# EAGLE design prog1840 (EAGLE 4.11)
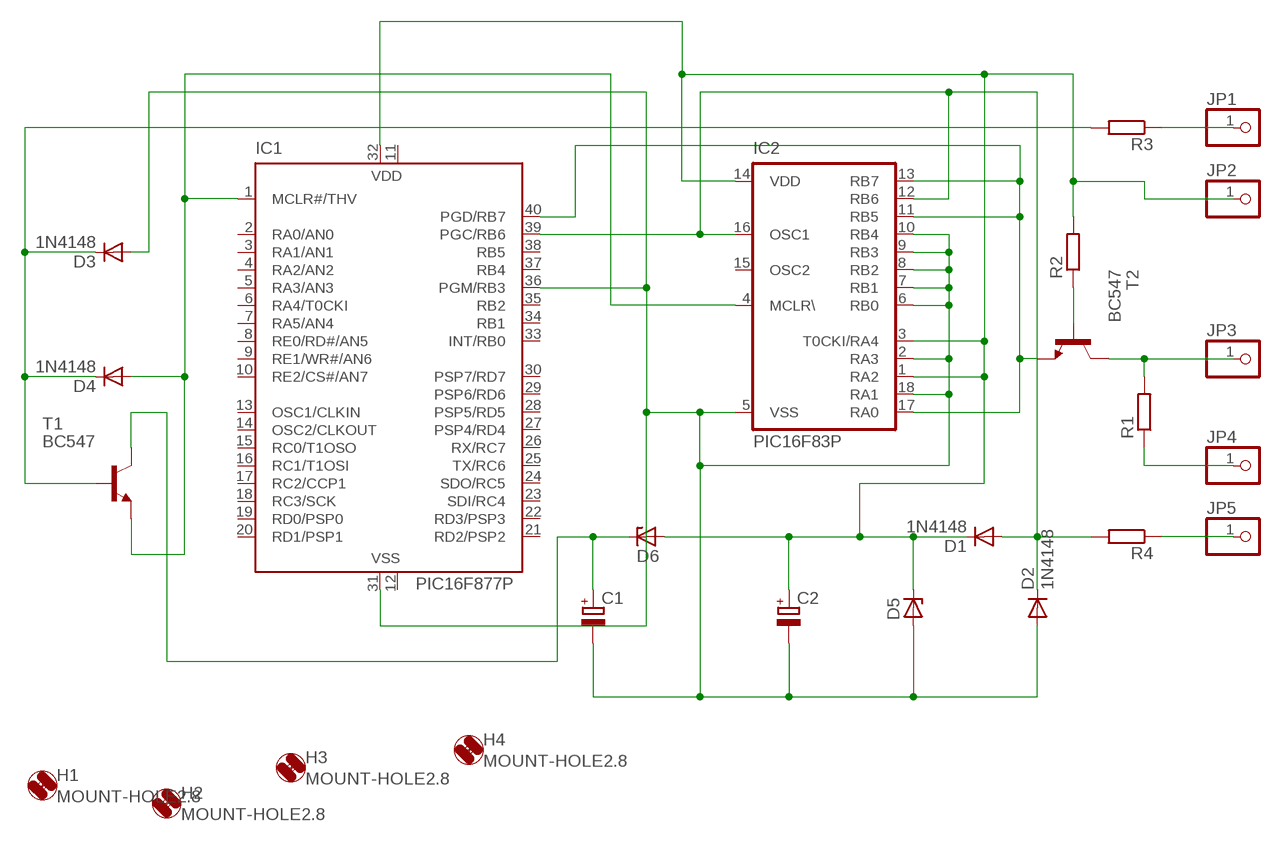
[diagram p0: schematic, sheet 1]

## Parts
C1  CPOL-EUE5-5  [E5-5]
C2  CPOL-EUE5-5  [E5-5]
D1  1N4148  [DO35-10]
D2  1N4148  [DO35-10]
D3  1N4148  [DO35-10]
D4  1N4148  [DO35-10]
D5  ZENER-DIODEF126-10  [F126Z10]
D6  ZENER-DIODEF126-10  [F126Z10]
H1  MOUNT-HOLE2.8  [2,8]
H2  MOUNT-HOLE2.8  [2,8]
H3  MOUNT-HOLE2.8  [2,8]
H4  MOUNT-HOLE2.8  [2,8]
IC1  PIC16F877P  [DIL40]
IC2  PIC16F83P  [DIL18]
JP1  PINHD-1X1  [1X01]
JP2  PINHD-1X1  [1X01]
JP3  PINHD-1X1  [1X01]
JP4  PINHD-1X1  [1X01]
JP5  PINHD-1X1  [1X01]
R1  R-EU_0204/5  [0204/5]
R2  R-EU_0204/5  [0204/5]
R3  R-EU_0204/5  [0204/5]
R4  R-EU_0204/5  [0204/5]
T1  BC547  [TO92]
T2  BC547  [TO92]

## Nets
N$1: JP3.1 R1.2 T2.3(C)
N$2: JP1.1 R3.1
N$3: JP4.1 R1.1
N$4: JP5.1 R4.1
N$5: R2.1 T2.2(B)
N$7: D1.A D2.C IC1.39(PGC/RB6) IC2.12(RB6) IC2.16(OSC1) R4.2
N$8: C2.+ D1.C D5.C D6.A IC1.32(VDD) IC2.1(RA2) IC2.3(T0CKI/RA4) IC2.14(VDD) JP2.1 R2.2
N$12: C1.+ D6.C T1.3(C)
N$14: D3.C D4.C R3.2 T1.2(B)
N$15: D4.A IC1.1(MCLR#/THV) IC2.4(MCLR\) T1.1(E)
N$17: C1.- C2.- D2.A D3.A D5.A IC1.31(VSS) IC1.36(PGM/RB3) IC2.2(RA3) IC2.5(VSS) IC2.6(RB0) IC2.7(RB1) IC2.8(RB2) IC2.9(RB3) IC2.10(RB4) IC2.18(RA1)
N$24: IC1.40(PGD/RB7) IC2.11(RB5) IC2.13(RB7) IC2.17(RA0) T2.1(E)
Unconnected: IC1.2(RA0/AN0) IC1.3(RA1/AN1) IC1.4(RA2/AN2) IC1.5(RA3/AN3) IC1.6(RA4/T0CKI) IC1.7(RA5/AN4) IC1.8(RE0/RD#/AN5) IC1.9(RE1/WR#/AN6) IC1.10(RE2/CS#/AN7) IC1.13(OSC1/CLKIN) IC1.14(OSC2/CLKOUT) IC1.15(RC0/T1OSO) IC1.16(RC1/T1OSI) IC1.17(RC2/CCP1) IC1.18(RC3/SCK) IC1.19(RD0/PSP0) IC1.20(RD1/PSP1) IC1.21(RD2/PSP2) IC1.22(RD3/PSP3) IC1.23(SDI/RC4) IC1.24(SDO/RC5) IC1.25(TX/RC6) IC1.26(RX/RC7) IC1.27(PSP4/RD4) IC1.28(PSP5/RD5) IC1.29(PSP6/RD6) IC1.30(PSP7/RD7) IC1.33(INT/RB0) IC1.34(RB1) IC1.35(RB2) IC1.37(RB4) IC1.38(RB5) IC2.15(OSC2)

## Power pins joined to a net without a drawn wire
VDD: IC1.11(VDD)
VSS: IC1.12(VSS)

## Library data of the parts
C1 C2 = rcl:CPOL-EU: POLARIZED CAPACITOR, European symbol
D1-D4 = diode:1N4148: DIODE high speed (Philips)
D5 D6 = diode:ZENER-DIODE: Z-Diode
H1-H4 = holes:MOUNT-HOLE: MOUNTING HOLE with drill center marker
IC1 = microchip:PIC16F87*: MICROCONTROLLER
IC2 = microchip:PIC16F8*: MICROCONTROLLER 8-Bit PIC16F8X Family - CMOS Flash/EEPROM Pin Compatible : PIC16F83, PIC16CR83, PIC16F84A, PIC16CR84 see also PIC16C*
JP1-JP5 = pinhead:PINHD-1X1: PIN HEADER
R1-R4 = rcl:R-EU_: RESISTOR, European symbol
T1 T2 = transistor:BC547: NPN TRANSISTOR

## Board
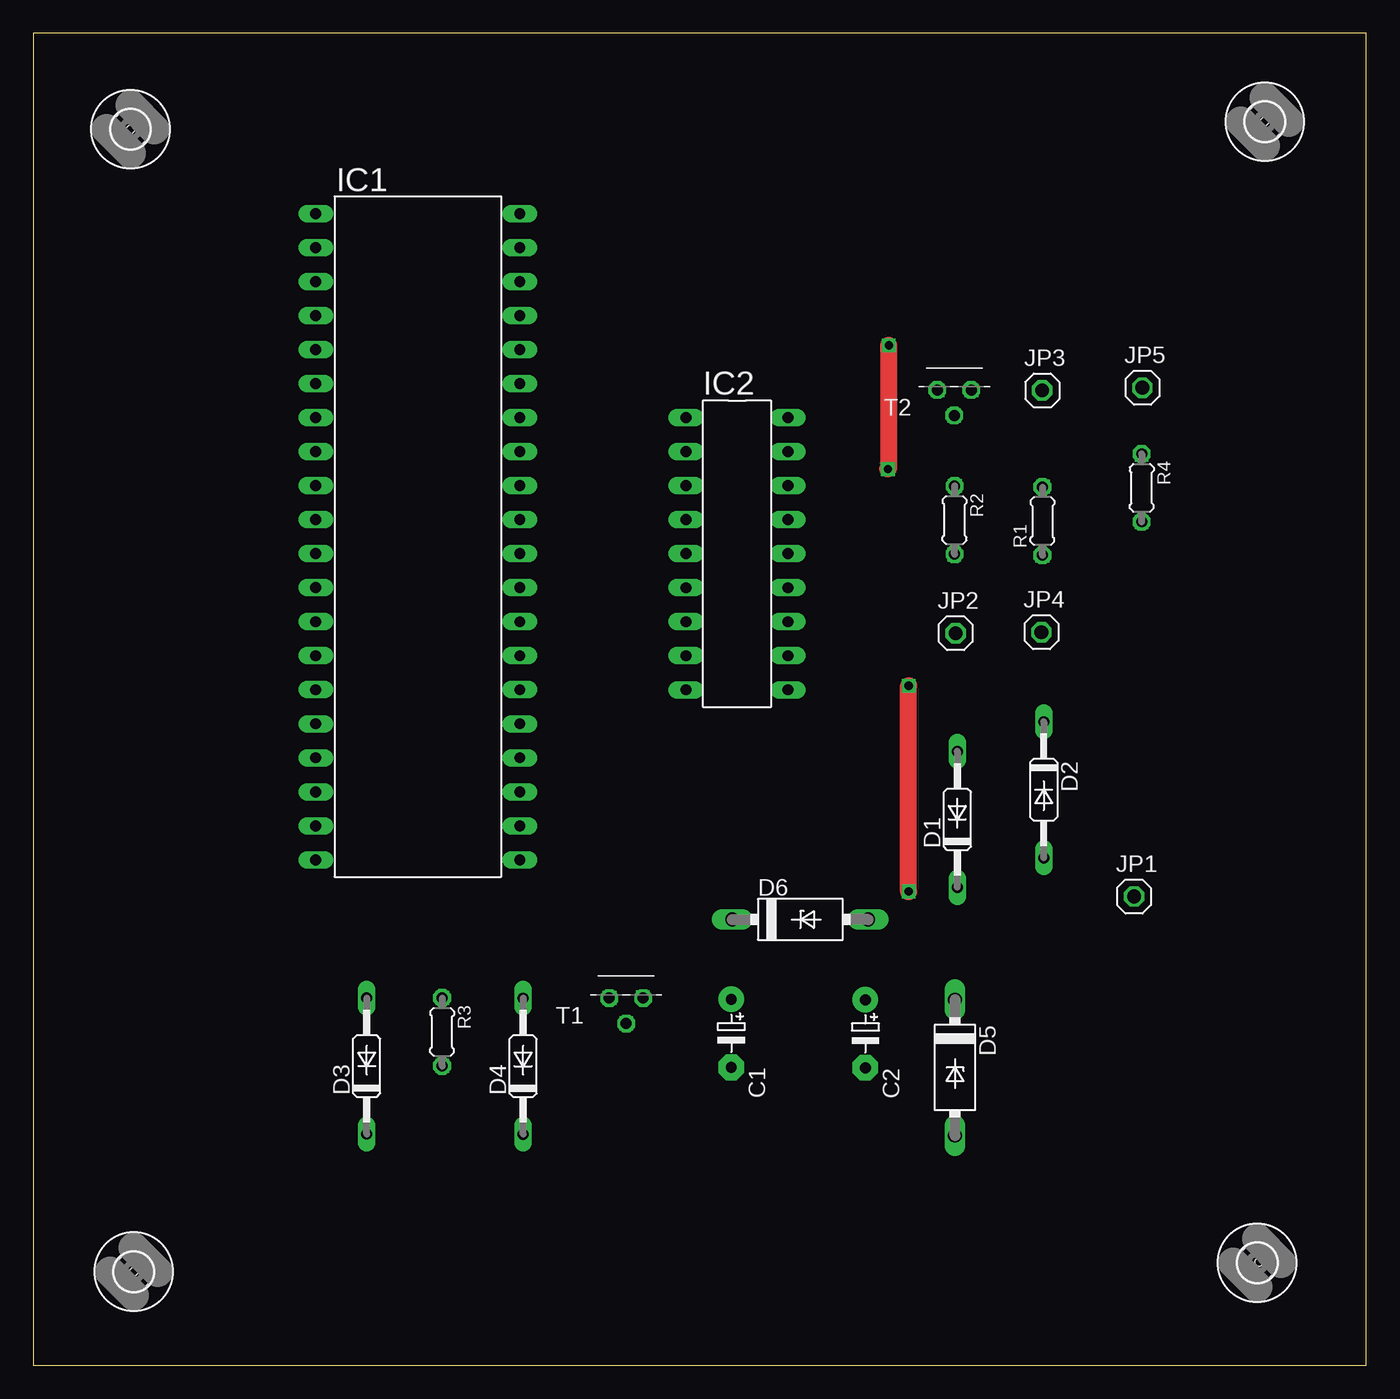
[diagram p1: board, top side]
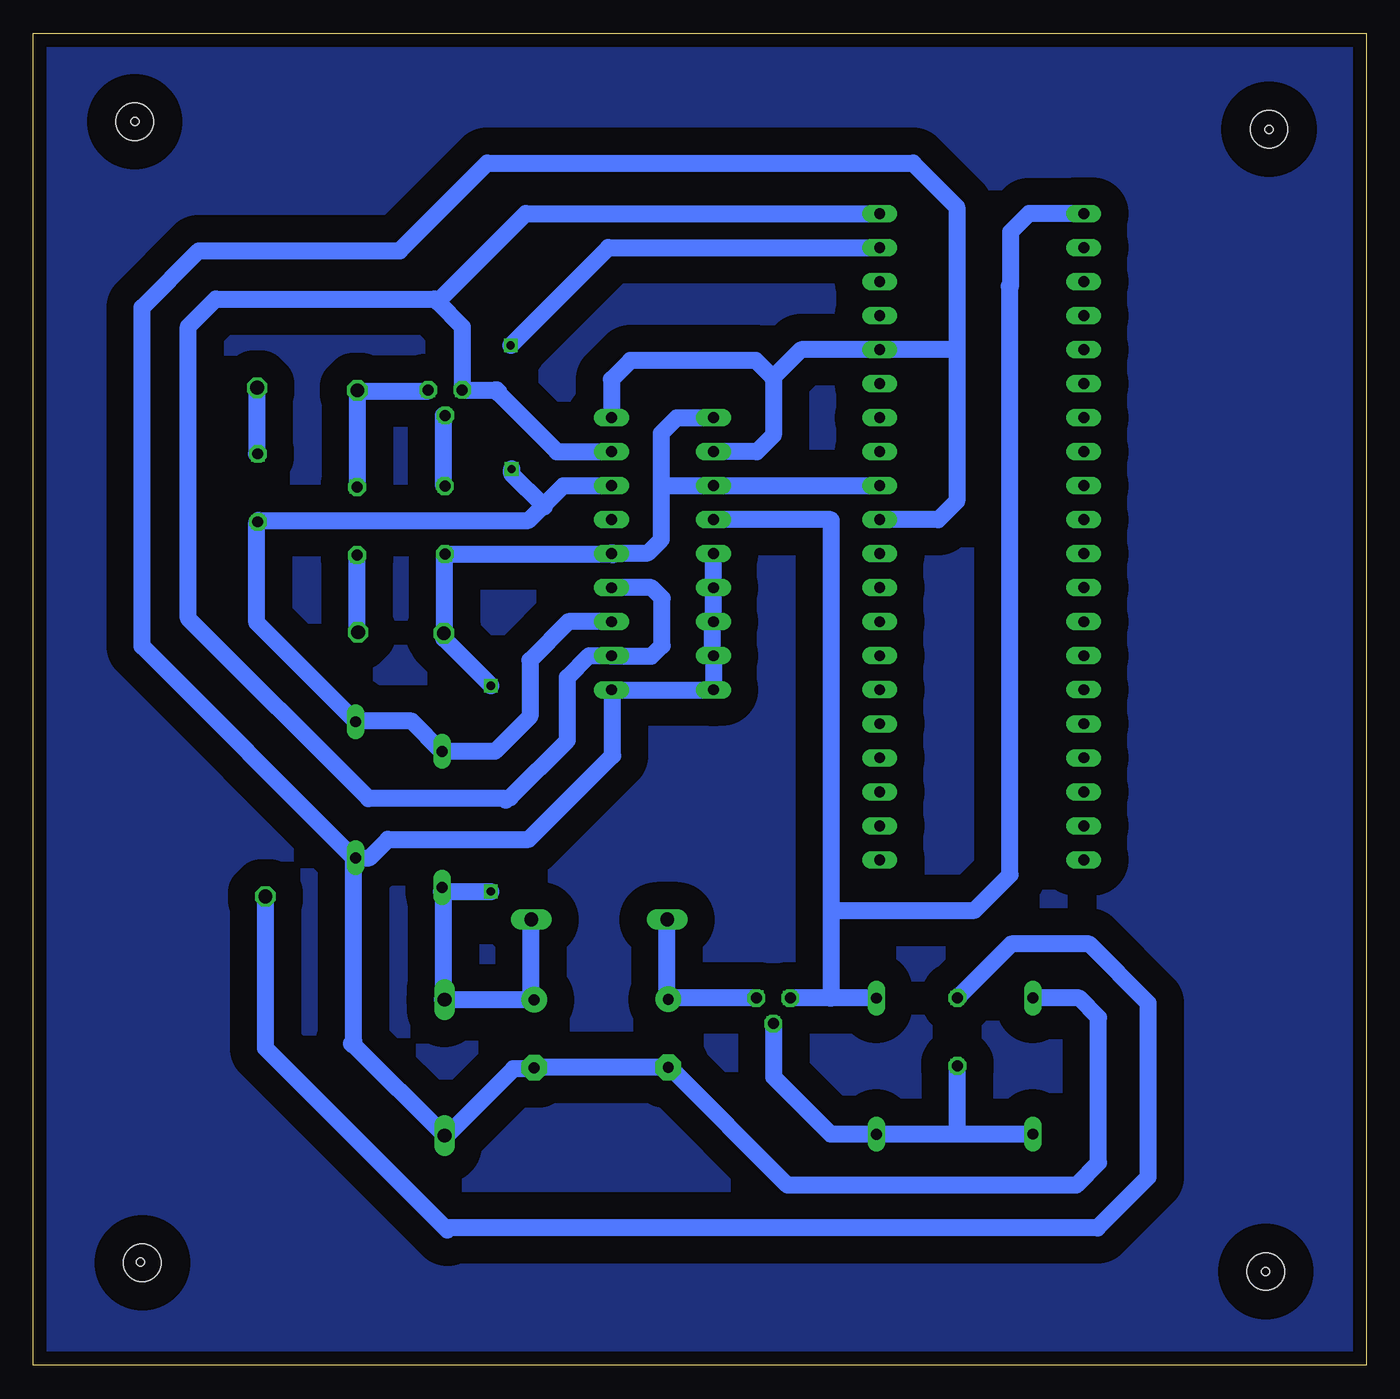
[diagram p2: board, bottom side, seen from below]

Size 99.52 x 99.47 mm. Coordinates in mm from the lower left corner, seen from the top.
Outline: 0,0 99.52,0 99.52,99.47 0,99.47 0,0
Copper layers (1*16): Top 0.035mm / dielectric 1.5mm / Bottom 0.035mm
Design rules "default": minimum track width 10mil, minimum drill 24mil, track to track 80mil, track to pad 80mil, pad to pad 80mil, via to via 80mil, smd to smd 80mil, copper to edge 40mil, drill to drill 8mil, minimum pad ring 10mil, minimum via ring 8mil, stop-mask expansion 4mil, vias tented up to drill 0mil, thermal gap 10mil
Holes 0.61 mm at 91.96,92.92 91.51,7.71 7.52,7 7.25,92.3

### Footprints (pad centres in the part's own frame; a part is rotated, then mirrored left to right if it is on the bottom)
E5-5 = drill 0.813 pad 1.905 round: + -2.54,0 | drill 0.813 pad 1.905 octagon: - 2.54,0
DO35-10 = drill 0.813 long: A 5.08,0; C -5.08,0
F126Z10 = drill 1.016 long: A 5.08,0; C -5.08,0
2,8 = hole 2.8: 0,0
DIL40 = drill 0.813 long: 1 -24.13,-7.62; 2 -21.59,-7.62; 3 -19.05,-7.62; 4 -16.51,-7.62; 5 -13.97,-7.62; 6 -11.43,-7.62; 7 -8.89,-7.62; 8 -6.35,-7.62; 9 -3.81,-7.62; 10 -1.27,-7.62; 11 1.27,-7.62; 12 3.81,-7.62; 13 6.35,-7.62; 14 8.89,-7.62; 15 11.43,-7.62; 16 13.97,-7.62; 17 16.51,-7.62; 18 19.05,-7.62; 19 21.59,-7.62; 20 24.13,-7.62; 21 24.13,7.62; 22 21.59,7.62; 23 19.05,7.62; 24 16.51,7.62; 25 13.97,7.62; 26 11.43,7.62; 27 8.89,7.62; 28 6.35,7.62; 29 3.81,7.62; 30 1.27,7.62; 31 -1.27,7.62; 32 -3.81,7.62; 33 -6.35,7.62; 34 -8.89,7.62; 35 -11.43,7.62; 36 -13.97,7.62; 37 -16.51,7.62; 38 -19.05,7.62; 39 -21.59,7.62; 40 -24.13,7.62
DIL18 = drill 0.813 long: 1 -10.16,-3.81; 2 -7.62,-3.81; 3 -5.08,-3.81; 4 -2.54,-3.81; 5 0,-3.81; 6 2.54,-3.81; 7 5.08,-3.81; 8 7.62,-3.81; 9 10.16,-3.81; 10 10.16,3.81; 11 7.62,3.81; 12 5.08,3.81; 13 2.54,3.81; 14 0,3.81; 15 -2.54,3.81; 16 -5.08,3.81; 17 -7.62,3.81; 18 -10.16,3.81
1X01 = drill 1.016 octagon: 1 0,0
0204/5 = drill 0.813 octagon: 1 -2.54,0; 2 2.54,0
TO92 = drill 0.813 octagon: 1 1.27,0; 2 0,1.905; 3 -1.27,0

### Placement (x,y rotation side)
C1  52.11,24.8 270 top
C2  62.13,24.77 270 top
D1  69,40.78 90 top
D2  75.45,42.99 270 top
D3  24.89,22.36 90 top
D4  36.56,22.35 90 top
D5  68.82,22.25 270 top
D6  57.27,33.3 0 top
H1  91.96,92.89 0 top
H2  7.24,92.32 0 top
H3  91.39,7.67 0 top
H4  7.49,7.01 0 top
IC1  28.7,61.89 270 top
IC2  52.54,60.62 270 top
JP1  82.18,35.02 0 top
JP2  68.87,54.68 0 top
JP3  75.34,72.81 0 top
JP4  75.28,54.77 0 top
JP5  82.82,73.02 0 top
R1  75.35,63.05 90 top
R2  68.79,63.13 270 top
R3  30.52,24.91 270 top
R4  82.77,65.54 270 top
T1  44.26,27.44 180 top
T2  68.77,72.85 180 top

### Tracks (layer width: path | path; a pad name or v marks a point on that pad's centre or on a via)
N$1
  Bottom 1.27: R1.2 75.3,65.65 75.3,72.65 | 75.3,72.65 75.3,72.82 75.33,72.82 JP3.1 75.4,72.75 75.43,72.75 | T2.3 70.14,72.75 75.2,72.75 75.29,72.65 75.3,72.65
N$2
  Bottom 1.27: R3.1 26.5,31.46 20.68,31.46 16.26,27.05 16.26,14.07 20.06,10.27 68.59,10.27 | 68.59,10.27 68.73,10.27 | 68.59,10.27 68.59,10.1 82.18,23.69 JP1.1
N$3
  Bottom 1.27: 75.37,54.68 75.37,54.67 | JP4.1 75.37,54.68 | R1.1 75.37,60.5 75.37,54.68
N$4
  Bottom 1.27: R4.1 82.87,68.08 82.82,68.14 JP5.1
N$5
  Bottom 1.27: T2.2 68.8,70.97 68.89,70.97 68.89,65.78 R2.1
N$6  (via drill 0.61)
  other vias: 21.03,86.03
N$7  (via drill 0.61)
  Top 1.27: v63.89,76.18 63.89,67.02 v63.81,66.94
  Bottom 1.27: IC2.16 59.95,65.7 61.44,64.21 | 61.44,64.21 62.55,63.1 82.73,63.1 82.82,63.01 82.81,63 R4.2 82.83,62.95 82.85,62.95 82.85,55.47 75.55,48.17 | 75.55,48.17 D2.C | 75.55,48.17 75.52,48.2 75.43,48.11 71.28,48.11 69.03,45.86 D1.A 69,45.83 68.98,45.81 68.94,45.86 65.05,45.86 62.45,48.46 62.45,52.66 59.56,55.54 IC2.12 | IC1.39 56.58,83.48 v63.89,76.18 | 61.44,64.21 61.37,64.14 | 61.44,64.21 | v63.81,66.94 63.81,66.58 61.44,64.21
N$8  (via drill 0.61)
  Top 1.27: v65.36,35.39 v65.36,50.76
  Bottom 1.27: 68.88,27.27 68.88,27.24 68.81,27.24 | 68.88,27.27 68.88,27.33 D5.C 68.98,27.33 | 68.81,27.24 68.81,27.17 | C2.+ 62.36,27.3 | 62.36,27.3 68.81,27.3 68.81,27.24 | IC2.1 51.47,70.78 52.62,69.63 52.62,65.69 | 52.62,65.69 52.62,61.69 53.64,60.68 56.26,60.68 | 56.44,60.62 | 56.44,60.62 IC2.14 56.35,60.64 56.38,60.68 | 56.26,60.68 56.38,60.68 | 56.38,60.68 56.44,60.62 | 52.62,65.69 52.61,65.7 IC2.3 48.6,65.7 48.58,65.68 48.56,65.7 IC1.32 | 56.38,60.68 56.47,60.59 | 56.26,60.68 56.26,60.56 56.3,60.59 R2.2 68.82,60.56 68.82,54.73 JP2.1 68.87,54.27 v65.36,50.76 | 68.88,27.27 68.89,27.27 | D1.C 68.89,35.59 68.89,35.39 | D6.A 62.36,27.3 | 68.89,35.39 69.07,35.39 | 68.89,35.39 v65.36,35.39 | 68.98,27.33 68.99,27.31 | 68.89,35.39 68.89,27.41 68.98,27.33
N$9  (via drill 0.61)
  other vias: 21.03,83.56
N$10  (via drill 0.61)
  other vias: 36.31,85.99
N$11  (via drill 0.61)
  other vias: 36.36,83.47
N$12
  Bottom 1.27: 52.24,27.31 52.24,27.34 C1.+ 52,27.34 | 52,27.34 52,27.27 | 52,27.27 | T1.3 52,27.44 52,27.34 | 52,27.27 52.03,27.27 52.19,27.44 D6.C
N$13  (via drill 0.61)
  other vias: 36.31,80.95
N$14
  Bottom 1.27: 36.54,17.27 36.54,17.2 | 36.54,17.27 D4.C 39.97,17.27 44.23,21.53 44.23,25.5 T1.2 | 36.54,17.27 36.54,17.28 | D3.C 24.89,17.3 25.01,17.42 25.16,17.27 30.84,17.27 | 30.84,17.27 36.54,17.27 | 30.84,17.27 30.84,17.34 30.52,17.65 R3.2
N$15
  Bottom 1.27: 36.54,27.44 36.54,27.43 D4.A | 36.54,27.44 39.93,27.44 | 39.93,27.44 40.02,27.44 | 40.02,27.44 T1.1 | 36.54,27.44 36.54,27.53 | IC2.4 39.97,63.16 39.93,63.12 39.93,34.16 | 40.02,27.44 40.02,27.45 39.93,27.54 | 39.93,34.16 39.84,34.16 39.66,33.98 29.24,33.98 26.59,36.63 26.59,80.52 26.64,80.57 26.55,80.66 26.55,84.64 25.18,86.02 IC1.1 | 39.93,27.44 39.93,27.58 39.93,34.16
N$16  (via drill 0.61)
  other vias: 36.31,78.39
N$17
  Bottom 1.27: 68.61,17.17 68.61,17.21 63.67,22.15 62.09,22.15 62.09,22.19 C2.- 62.13,22.26 C1.- 52.05,22.26 52.03,22.28 43.2,13.45 21.65,13.45 19.97,15.13 19.97,25.99 21.42,27.44 D3.A | 68.61,17.17 D5.A | 68.61,17.17 68.61,17.16 | D5.A 68.79,17.14 | 48.8,52.93 48.8,52.92 | 48.8,52.93 IC2.8 48.68,52.95 48.68,50.41 | 48.8,52.93 48.8,55.47 IC2.7 IC2.6 | 48.68,50.41 | IC2.9 48.68,50.41 | IC2.9 48.74,50.47 | IC2.6 48.73,58.1 48.8,58.17 | IC2.5 48.73,60.6 48.68,60.56 48.73,60.51 IC2.6 | IC2.9 48.73,50.44 48.75,50.42 48.79,50.46 IC2.10 56.35,50.41 56.44,50.32 56.27,50.14 56.27,45.55 62.53,39.28 73.04,39.28 74.42,37.91 75.34,37.91 | IC2.18 56.35,73.63 54.94,75.04 45.58,75.04 44.34,73.8 | 44.3,73.76 44.25,73.72 44.25,69.48 45.49,68.24 IC2.2 | 44.3,73.76 44.34,73.8 | 75.34,37.91 D2.A 75.53,37.83 | 44.34,73.8 | 75.6,37.78 75.58,37.78 75.53,37.83 | D5.A 75.6,23.95 75.7,23.95 75.79,24.05 75.6,24.23 75.6,37.78 | IC1.31 31.94,63.16 30.57,64.53 30.57,75.93 | 30.57,75.93 30.57,86.52 33.83,89.79 65.63,89.79 72.16,83.25 87.17,83.25 91.41,79.02 91.41,53.71 75.53,37.83 | 75.34,37.91 75.34,37.78 75.6,37.78 | 30.57,75.93 30.65,75.93 30.7,75.88 | 30.7,75.88 30.72,75.86 | 44.3,73.76 | 44.3,73.76 42.2,75.86 IC1.36 30.68,75.86 | 30.7,75.88 30.68,75.86 | 30.7,75.88 | 30.68,75.86 30.65,75.84
N$18  (via drill 0.61)
  other vias: 36.31,75.88
N$19  (via drill 0.61)
  other vias: 36.36,73.32
N$20  (via drill 0.61)
  other vias: 36.36,70.8
N$21  (via drill 0.61)
  other vias: 36.31,68.28
N$22  (via drill 0.61)
  other vias: 36.31,65.68
N$23  (via drill 0.61)
  other vias: 36.31,63.16
N$24
  Bottom 1.27: IC2.17 60.43,68.24 64.83,72.65 | 64.83,72.65 64.98,72.79 | 64.98,72.79 65.04,72.85 | 67.5,72.83 T2.1 | 67.42,72.85 67.48,72.85 67.5,72.83 | 67.42,72.85 67.42,72.83 | IC2.13 53.36,58.08 52.58,57.29 52.58,53.76 53.37,52.97 56.38,52.97 IC2.11 58.02,53 59.65,51.38 59.65,46.69 63.92,42.41 64.02,42.41 64.22,42.2 64.35,42.33 74.5,42.33 87.96,55.79 87.96,77.58 85.9,79.65 69.57,79.65 69.35,79.43 | 64.98,72.79 64.99,72.78 | 67.5,72.83 67.5,77.58 69.35,79.43 | 64.83,72.65 64.77,72.71 64.92,72.85 67.42,72.85 | IC1.40 62.76,86.02 69.35,79.43
N$25  (via drill 0.61)
  other vias: 36.31,60.6
N$26  (via drill 0.61)
  other vias: 36.31,58.04
N$27  (via drill 0.61)
  other vias: 48.72,70.76
N$28  (via drill 0.61)
  other vias: 56.36,70.76
N$29  (via drill 0.61)
  other vias: 56.32,68.24
N$30  (via drill 0.61)
  other vias: 48.72,68.24
N$31  (via drill 0.61)
  other vias: 48.77,65.68
N$32  (via drill 0.61)
  other vias: 56.36,65.72
N$33  (via drill 0.61)
  other vias: 56.32,60.6
N$34  (via drill 0.61)
  other vias: 56.36,63.21
N$35  (via drill 0.61)
  other vias: 48.72,63.16
N$36  (via drill 0.61)
  other vias: 48.77,60.56
N$37  (via drill 0.61)
  other vias: 48.72,58.09
N$38  (via drill 0.61)
  other vias: 56.32,58.09
N$39  (via drill 0.61)
  other vias: 56.36,55.57
N$40  (via drill 0.61)
  other vias: 48.77,55.57
N$41  (via drill 0.61)
  other vias: 48.72,53.01
N$42  (via drill 0.61)
  other vias: 56.36,53.01
N$43  (via drill 0.61)
  other vias: 56.36,50.45
N$44  (via drill 0.61)
  other vias: 48.72,50.45
N$45  (via drill 0.61)
  other vias: 36.31,55.52
N$46  (via drill 0.61)
  other vias: 36.31,53.01
N$47  (via drill 0.61)
  other vias: 36.31,50.4
N$48  (via drill 0.61)
  other vias: 36.31,47.93
N$49  (via drill 0.61)
  other vias: 36.36,45.41
N$50  (via drill 0.61)
  other vias: 36.31,42.85
N$51  (via drill 0.61)
  other vias: 36.31,40.25
N$52  (via drill 0.61)
  other vias: 36.31,37.82
N$53  (via drill 0.61)
  other vias: 68.86,54.69
N$54  (via drill 0.61)
  other vias: 68.77,60.56
N$55  (via drill 0.61)
  other vias: 69.04,45.9
N$56  (via drill 0.61)
  other vias: 68.81,65.68
N$57  (via drill 0.61)
  other vias: 68.77,70.93
N$58  (via drill 0.61)
  other vias: 67.53,72.83
N$59  (via drill 0.61)
  other vias: 70.05,72.83
N$60  (via drill 0.61)
  other vias: 21.08,80.95
N$61  (via drill 0.61)
  other vias: 21.08,78.44
N$62  (via drill 0.61)
  other vias: 21.12,75.88
N$63  (via drill 0.61)
  other vias: 21.08,73.32
N$64  (via drill 0.61)
  other vias: 21.12,70.8
N$65  (via drill 0.61)
  other vias: 21.08,68.28
N$66  (via drill 0.61)
  other vias: 21.08,65.72
N$67  (via drill 0.61)
  other vias: 21.08,63.21
N$68  (via drill 0.61)
  other vias: 21.08,60.6
N$69  (via drill 0.61)
  other vias: 21.08,58.09
N$70  (via drill 0.61)
  other vias: 21.08,55.48
N$71  (via drill 0.61)
  other vias: 21.08,53.01
N$72  (via drill 0.61)
  other vias: 21.08,50.4
N$73  (via drill 0.61)
  other vias: 21.08,47.93
N$74  (via drill 0.61)
  other vias: 21.08,45.37
N$75  (via drill 0.61)
  other vias: 21.08,42.85
N$76  (via drill 0.61)
  other vias: 21.08,40.29
N$77  (via drill 0.61)
  other vias: 21.08,37.78
N$78  (via drill 0.61)
  other vias: 75.26,54.77
N$79  (via drill 0.61)
  other vias: 75.35,60.47
N$80  (via drill 0.61)
  other vias: 75.39,65.64
N$81  (via drill 0.61)
  other vias: 75.35,72.79
N$82  (via drill 0.61)
  other vias: 82.81,72.96
N$83  (via drill 0.61)
  other vias: 82.77,68.02
N$84  (via drill 0.61)
  other vias: 82.77,62.99
N$85  (via drill 0.61)
  other vias: 75.44,48.06
N$86  (via drill 0.61)
  other vias: 75.44,37.95
N$87  (via drill 0.61)
  other vias: 69.04,35.7
N$88  (via drill 0.61)
  other vias: 62.41,33.32
N$89  (via drill 0.61)
  other vias: 62.15,27.36
N$90  (via drill 0.61)
  other vias: 62.15,22.24
N$91  (via drill 0.61)
  other vias: 52.12,27.4
N$92  (via drill 0.61)
  other vias: 52.12,22.32
N$93  (via drill 0.61)
  other vias: 68.9,17.11
N$94  (via drill 0.61)
  other vias: 68.81,27.36
N$95  (via drill 0.61)
  other vias: 52.21,33.32
N$96  (via drill 0.61)
  other vias: 45.5,27.49
N$97  (via drill 0.61)
  other vias: 44.26,25.55
N$98  (via drill 0.61)
  other vias: 43.03,27.45
N$99  (via drill 0.61)
  other vias: 36.58,27.45
N$100  (via drill 0.61)
  other vias: 36.58,17.25
N$101  (via drill 0.61)
  other vias: 82.2,35.04
N$102  (via drill 0.61)
  other vias: 24.92,27.45
N$103  (via drill 0.61)
  other vias: 24.87,17.34
N$104  (via drill 0.61)
  other vias: 30.53,22.37
N$105  (via drill 0.61)
  other vias: 30.53,27.45
N$106
  pour Bottom: 0.63,0.47 0.63,98.66 98.64,98.66 98.64,0.47